# Altium schematic sheet T_module.SchDoc: UWB with AoA
size A4; DrawnBy: Florian Henzer; Organization: Center for Poject Based Learning; DocumentNumber: Semester Thesis; Revision: A; SheetNumber: 1; SheetTotal: 1
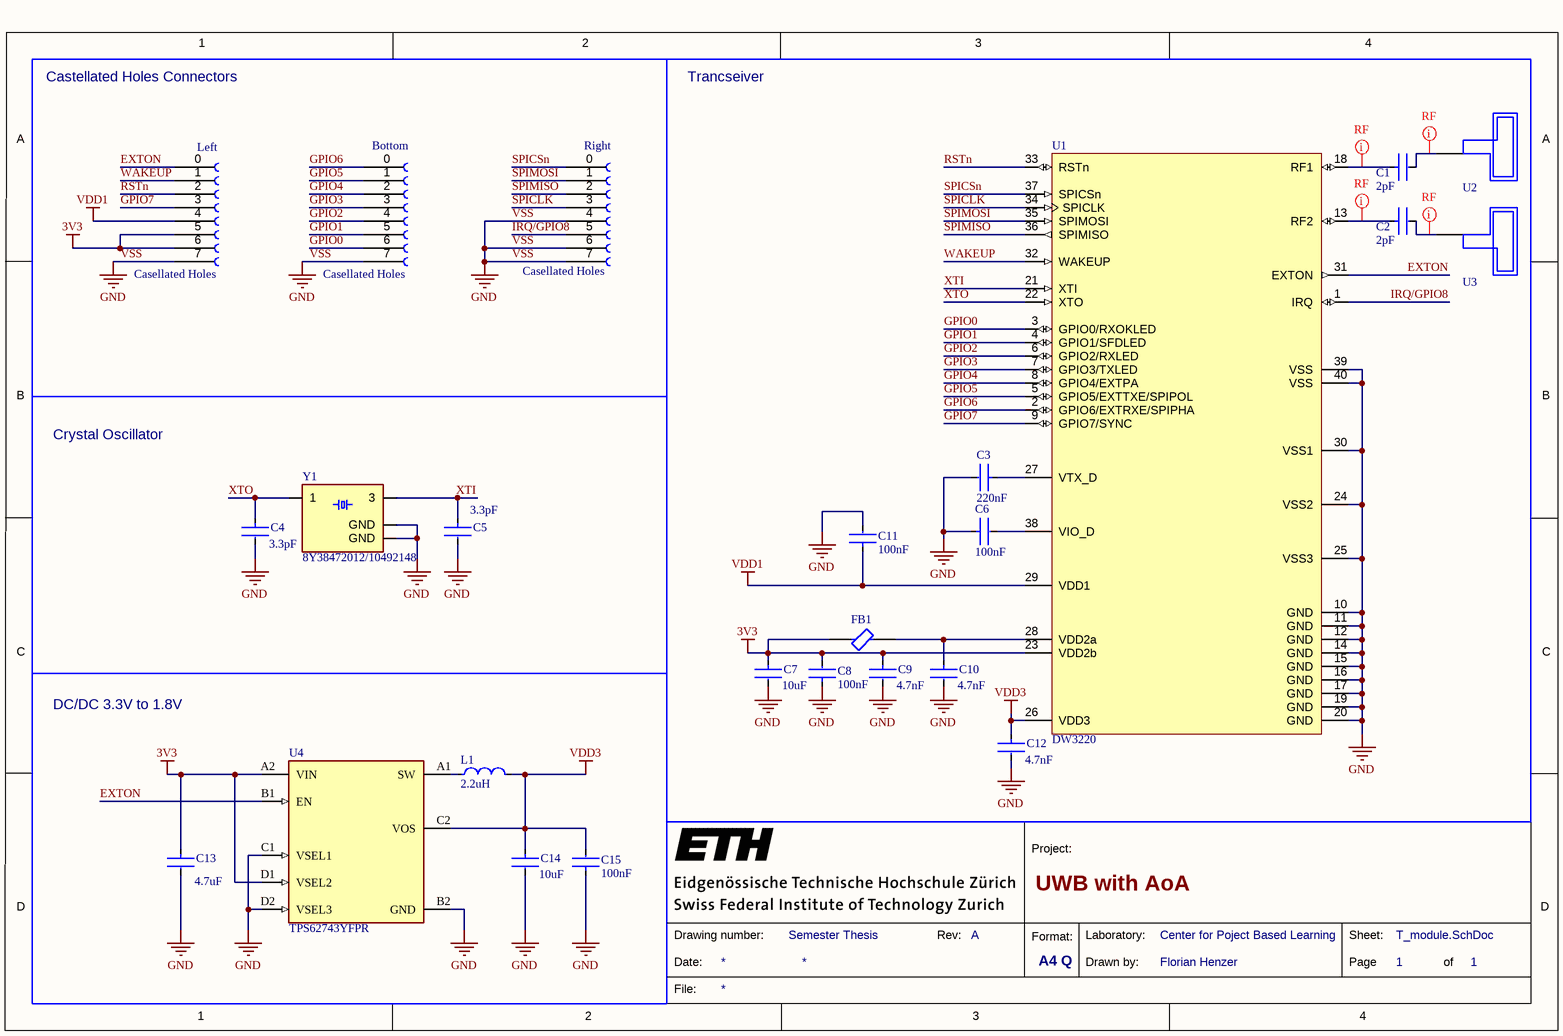
[diagram p0: T_module.SchDoc]

## Parts
Bottom  Casellated Holes  [8 Castelted holes]
C1  Capacitance: 2pF  [FP-GJM033-0_03-IPC_B]  (hidden comment: GJM0335C1E2R0WB01D)
C2  Capacitance: 2pF  [FP-GJM033-0_03-IPC_B]  (hidden comment: GJM0335C1E2R0WB01D)
C3  Capacitance: 220nF  [FP-CL03-IPC_B]  (hidden comment: CL03A224KQ3NNNC)
C4  Capacitance: 3.3pF  [FP-GRM033-0_03-IPC_A]  (hidden comment: GRM0335C1H3R3CA01D)
C5  Capacitance: 3.3pF  [FP-GRM033-0_03-IPC_A]  (hidden comment: GRM0335C1H3R3CA01D)
C6  Capacitance: 100nF  [FP-CL03-IPC_B]  (hidden comment: CL03A104KQ3NNNH)
C7  Capacitance: 10uF  [FP-GRM155-0_2-0_1-IPC_B]  (hidden comment: GRM155R60J106ME47D)
C8  Capacitance: 100nF  [FP-CL03-IPC_B]  (hidden comment: CL03A104KQ3NNNH)
C9  Capacitance: 4.7nF  [FP-GRM033-0_03-IPC_A]  (hidden comment: GRM033R71A472KA01D)
C10  Capacitance: 4.7nF  [FP-GRM033-0_03-IPC_A]  (hidden comment: GRM033R71A472KA01D)
C11  Capacitance: 100nF  [FP-CL03-IPC_B]  (hidden comment: CL03A104KQ3NNNH)
C12  Capacitance: 4.7nF  [FP-GRM033-0_03-IPC_A]  (hidden comment: GRM033R71A472KA01D)
C13  Capacitance: 4.7uF  [FP-GRM035-0_09-IPC_B]  (hidden comment: GRM035R60J475ME15D)
C14  Capacitance: 10uF  [FP-GRM155-0_2-0_1-IPC_C]  (hidden comment: GRM155R60J106ME47D)
C15  Capacitance: 100nF  [FP-CL03-IPC_B]  (hidden comment: CL03A104KQ3NNNH)
FB1  MPZ0603S330HT000  [FP-MPZ0603-IPC_B]  (value not drawn)
L1  Inductance: 2.2uH  [FP-DFE201610C-IPC_C]  (hidden comment: 1285AS-H-2R2M=P2)
Left  Casellated Holes  [8 Castelted holes]
Right  Casellated Holes  [8 Castelted holes]
U1  DW3220  [QFN40P500X500X40_HS-40N]
U2  AH086M555003-T  [AH086M]  (value not drawn)
U3  AH086M555003-T  [AH086M]  (value not drawn)
U4  TPS62743YFPR  [FP-YFP0008-C01-MFG]
Y1  8Y38472012/10492148  [OSCSC320X250X100N - small Footprint]

## Blocks framed on the sheet
Castellated Holes Connectors: Bottom Left Right
Trancseiver: C1-C3 C6-C12 FB1 U1-U3
Crystal Oscillator: C4 C5 Y1
DC/DC 3.3V to 1.8V: C13-C15 L1 U4

## Nets
3V3: C7.1 C8.2 C9.1 C13.1 FB1.1 Left.5 Left.6 U1.23(VDD2b) U4.A2(VIN) U4.D1(VSEL2)
VDD1: C11.1 Left.4 U1.29(VDD1)
VDD3: C12.1 C14.1 C15.2 L1.2 U1.26(VDD3) U4.C2(VOS)
VSS: Bottom.7 C3.2 C4.2 C5.2 C6.1 C7.2 C8.1 C9.2 C10.2 C11.2 C12.2 C13.2 C14.2 C15.1 Left.7 Right.4 Right.6 Right.7 U1.10(GND) U1.11(GND) U1.12(GND) U1.14(GND) U1.15(GND) U1.16(GND) U1.17(GND) U1.19(GND) U1.20(GND) U1.24(VSS2) U1.25(VSS3) U1.30(VSS1) U1.39(VSS) U1.40(VSS) U4.B2(GND) U4.C1(VSEL1) U4.D2(VSEL3) Y1.2(GND) Y1.4(GND)  [also labelled GND]
EXTON: Left.0 U1.31(EXTON) U4.B1(EN)
GPIO0: Bottom.6 U1.3(GPIO0/RXOKLED)
GPIO1: Bottom.5 U1.4(GPIO1/SFDLED)
GPIO2: Bottom.4 U1.6(GPIO2/RXLED)
GPIO3: Bottom.3 U1.7(GPIO3/TXLED)
GPIO4: Bottom.2 U1.8(GPIO4/EXTPA)
GPIO5: Bottom.1 U1.5(GPIO5/EXTTXE/SPIPOL)
GPIO6: Bottom.0 U1.2(GPIO6/EXTRXE/SPIPHA)
GPIO7: Left.3 U1.9(GPIO7/SYNC)
IRQ/GPIO8: Right.5 U1.1(IRQ)
RSTn: Left.2 U1.33(RSTn)
SPICLK: Right.3 U1.34(SPICLK)
SPICSn: Right.0 U1.37(SPICSn)
SPIMISO: Right.2 U1.36(SPIMISO)
SPIMOSI: Right.1 U1.35(SPIMOSI)
WAKEUP: Left.1 U1.32(WAKEUP)
XTI: C5.1 U1.21(XTI) Y1.3
XTO: C4.1 U1.22(XTO) Y1.1
NetC1_1: C1.1 U1.18(RF1)
NetC1_2: C1.2 U2.1
NetC2_1: C2.1 U1.13(RF2)
NetC2_2: C2.2 U3.1
NetC3_1: C3.1 U1.27(VTX_D)
NetC6_2: C6.2 U1.38(VIO_D)
NetC10_1: C10.1 FB1.2 U1.28(VDD2a)
NetL1_1: L1.1 U4.A1(SW)

## Layout directives
net class RF: NetC1_1, NetC1_2, NetC2_1, NetC2_2

## Notes on the sheet
- 1
- 2
- 3
- 4
- A
- B
- C
- Project:
- D
- Date:
- Drawing number:
- Rev:
- Format:
- A4 Q
- Drawn by:
- Laboratory:
- Page
- Sheet:
- of
- File:

## Library data of the parts
C1 C2 = CMP-2010-00751-2: Ceramic Capacitor 2pF ±0.05pF 25V C0G 0201 (0603 Metric); Package Quantity: 15000; Min Operating Temperature: -55°C; Thickness: 0.013inch; Max Operating Temperature: 125°C; Voltage Rating: 25V; Voltage Rating (DC): 25V; Packaging: Tape and Reel; Width: 0.012inch; Length: 0.6mm; Height: 0.3mm; Mount: Surface Mount; Case Code (Imperial): 0201; Radiation Hardening: No; Dielectric: C0G; Termination: SMD/SMT; Case Code (Metric): 0603; Case/Package: 0201; Depth: 0.3mm
C3 = CMP-2010-00678-2: Cap Ceramic 220nF 6.3V X5R ±10% Pad SMD 0201 +85°C T/R; Thickness: 0.013inch; Min Operating Temperature: -55°C; Case/Package: 0201; Max Operating Temperature: 85°C; Mount: Surface Mount; Tolerance: 10%; Case Code (Imperial): 0201; Packaging: Tape and Reel; Case Code (Metric): 0603; Dielectric: X5R; Height: 0.3mm; Contact Plating: Tin; Length: 0.6mm; Depth: 0.3mm; Voltage Rating: 6.3V; Width: 0.012inch; Radiation Hardening: No
C4 C5 = CMP-2010-01116-2: Chip Multilayer Ceramic Capacitors for General Purpose, 0201, 3.3pF, C0G, 30ppm/°C, 0.25pF, 50V; Voltage Rating (DC): 50V; Length: 0.024inch; Packaging: Tape and Reel; Termination: SMD/SMT; Min Operating Temperature: -55°C; Width: 0.012inch; Depth: 0.3mm; Case Code (Metric): 0603; Thickness: 0.013inch; Case/Package: 0201; Dielectric: C0G; Mount: Surface Mount; Max Operating Temperature: 125°C; Voltage Rating: 50V; Lead Free: Lead Free; Package Quantity: 1; Case Code (Imperial): 0201
C6 C8 C11 C15 = CMP-13271-001518-1: Cap Ceramic 100nF 6.3V X5R ±10% Pad SMD 0201 +85°C T/R; Case Code (Metric): 0603; Radiation Hardening: No; Height: 0.3mm; Tolerance: 10%; Max Operating Temperature: 85°C; Thickness: 0.013inch; Voltage Rating: 6.3V; Dielectric: X5R; Depth: 0.3mm; Mount: Surface Mount; Min Operating Temperature: -55°C; Width: 0.012inch; Case Code (Imperial): 0201; Packaging: Tape and Reel; Length: 0.6mm; Case/Package: 0201; Package Quantity: 15000
C7 C14 = CMP-06035-022355-1: Chip Multilayer Ceramic Capacitors for General Purpose, 0402, 10uF, X5R, 15%, 20%, 6.3V; Mount: Surface Mount; Tolerance: 20%; Width: 0.02inch; Voltage Rating: 6.3V; Length: 0.039inch; Case Code (Imperial): 0402; Voltage Rating (DC): 6.3V; Max Operating Temperature: 85°C; Thickness: 0.024inch; Min Operating Temperature: -55°C; Packaging: Tape and Reel; Case/Package: 0402; Dielectric: X5R; Case Code (Metric): 1005
C9 C10 C12 = CMP-2010-01686-2: Chip Multilayer Ceramic Capacitors for General Purpose, 0201, 4700pF, X7R, 15%, 10%, 10V; REACH SVHC: No SVHC; Termination: SMD/SMT; Case/Package: 0201; Package Quantity: 1; Length: 0.6mm; Case Code (Metric): 0603; Min Operating Temperature: -55°C; Voltage: 10V; Radiation Hardening: No; Dielectric: X7R; Thickness: 0.013inch; Max Operating Temperature: 125°C; Case Code (Imperial): 0201; Width: 0.012inch; Voltage Rating (DC): 10V; Packaging: Tape and Reel; Voltage Rating: 10V; Lead Free: Lead Free; Mount: Surface Mount; Tolerance: 10%; Height: 0.3mm; Depth: 0.3mm; Material: Ceramic
C13 = CMP-06035-019701-1: Chip Multilayer Ceramic Capacitors for General Purpose, 0201, 4.7uF, X5R, 15%, 20%, 6.3V; Max Operating Temperature: 85°C; Packaging: Tape and Reel; Voltage Rating: 6.3V; Min Operating Temperature: -55°C; Case/Package: 0201; Voltage Rating (DC): 6.3V; Tolerance: 20%; Length: 0.024inch; Dielectric: X5R; Case Code (Imperial): 0201; Case Code (Metric): 0603; Width: 0.012inch; Mount: Surface Mount; Thickness: 0.022inch
FB1 = CMP-08257-000038-1: CHIP BEADS FOR GENERAL SIGNAL LI; Number of Lines: 1; Max Current Rating: 1.6A; DC Resistance (DCR): 50mR; Case/Package: 0201; Min Operating Temperature: -55°C; Max Operating Temperature: 125°C; Mount: Surface Mount; RoHS Compliant: Yes; Packaging: Cut Tape; Case Code (Metric): 0603; Case Code (Imperial): 0201
L1 = CMP-06042-000201-1: Shielded Wirewound Inductor 2.2uH 20% 1200mA 0.204Ω 0806 (2016); DC Resistance (DCR): 204mR; Current Rating: 1.5A; Core Material: Ferrite; Max DC Current: 1.2A; Test Frequency: 1MHz; Height - Seated (Max): 0.039inch; Min Operating Temperature: -40°C; Width: 0.063inch; Packaging: Tape and Reel; Case Code (Imperial): 0805; Mount: Surface Mount; Shielding: Shielded; Resistor Type: Wirewound; Case Code (Metric): 2012; Max Operating Temperature: 85°C; Depth: 1.6mm; Case/Package: 0805; Length: 0.079inch; Tolerance: 20%
U1 = CMP-01416-1: Ultra-low power Wi-Fi 802.11b/g/n, without mounted antenna; Manufacturer: Qorvo; Part # Aliases: DWM3000; Interface: SPI; MCU: External; Antenna Ports(#): 2; Data Rate: 850 kbps, 6.8 Mbps; 802.15 Standards: 4a, 4z-BPRF; Package(mm): 5 x 5; PDoA Support: Yes; Ranging Accuracy(cm): < 10; Security Features: 4z Compliant + AES; Voltage(V): 2.4 to 3.6; Angle of Arrival(degrees): < 5; UWB Channels: 5, 9; BOM Ext Components(#): 10; Product Type: RF Transceiver; Series: DWM3000; Package Type: QFN; Subcategory: Wireless & RF Integrated Circuits
U2 U3 = CMP-00997-1: 3.5GHz, 5.6GHz WiMax™ Chip RF Antenna 3.1GHz ~ 8GHz 2.6dBi, 0.7dBi Solder Surface Mount; Frequency: 5.55GHz; Impedance: 50R; Number of Bands: 1; Mount: Surface Mount; Min Operating Temperature: -20°C; Max Operating Temperature: 80°C; Packaging: Tape and Reel; Package Quantity: 1; Termination: Solder; Max Frequency: 8GHz; Length: 8mm; Height: 0.039inch; Width: 6mm; Radiation Hardening: No; REACH SVHC: Unknown
U4 = CMP-04918-000507-1: IC REG BUCK PROG 300MA 8DSBGA; Output Configuration: Positive; Switching Frequency: 1.2MHz; Number of Outputs: 1; Min Input Voltage: 2.15V; Min Output Voltage: 1.2V; Max Input Voltage: 5.5V; Synchronous Rectifier: Yes; Max Output Voltage: 3.3V; Quiescent Current: 300nA; Max Operating Temperature: 85°C; Lead Free: Lead Free; Min Operating Temperature: -40°C; Packaging: Tape and Reel; RoHS Compliant: Yes; Mount: Surface Mount; Output Current: 300mA
Y1 = ABM8G-14.31818MHZ-B4Y-T: https://www.digikey.ch/de/products/detail/txc-corporation/8Y38472012/10492148; Package: None; Price: None; Value: *; MP: 8Y38472012/10492148; Availability: Unavailable